# EasyEDA schematic 1-Schematic_Utilipi.json

## Sheets
1 Périphériques: TITLE: UtiliPi; REV: 3.0; Date: 2018-08-31; Sheet: 2/4; Drawn By: Nathan Bourgeois
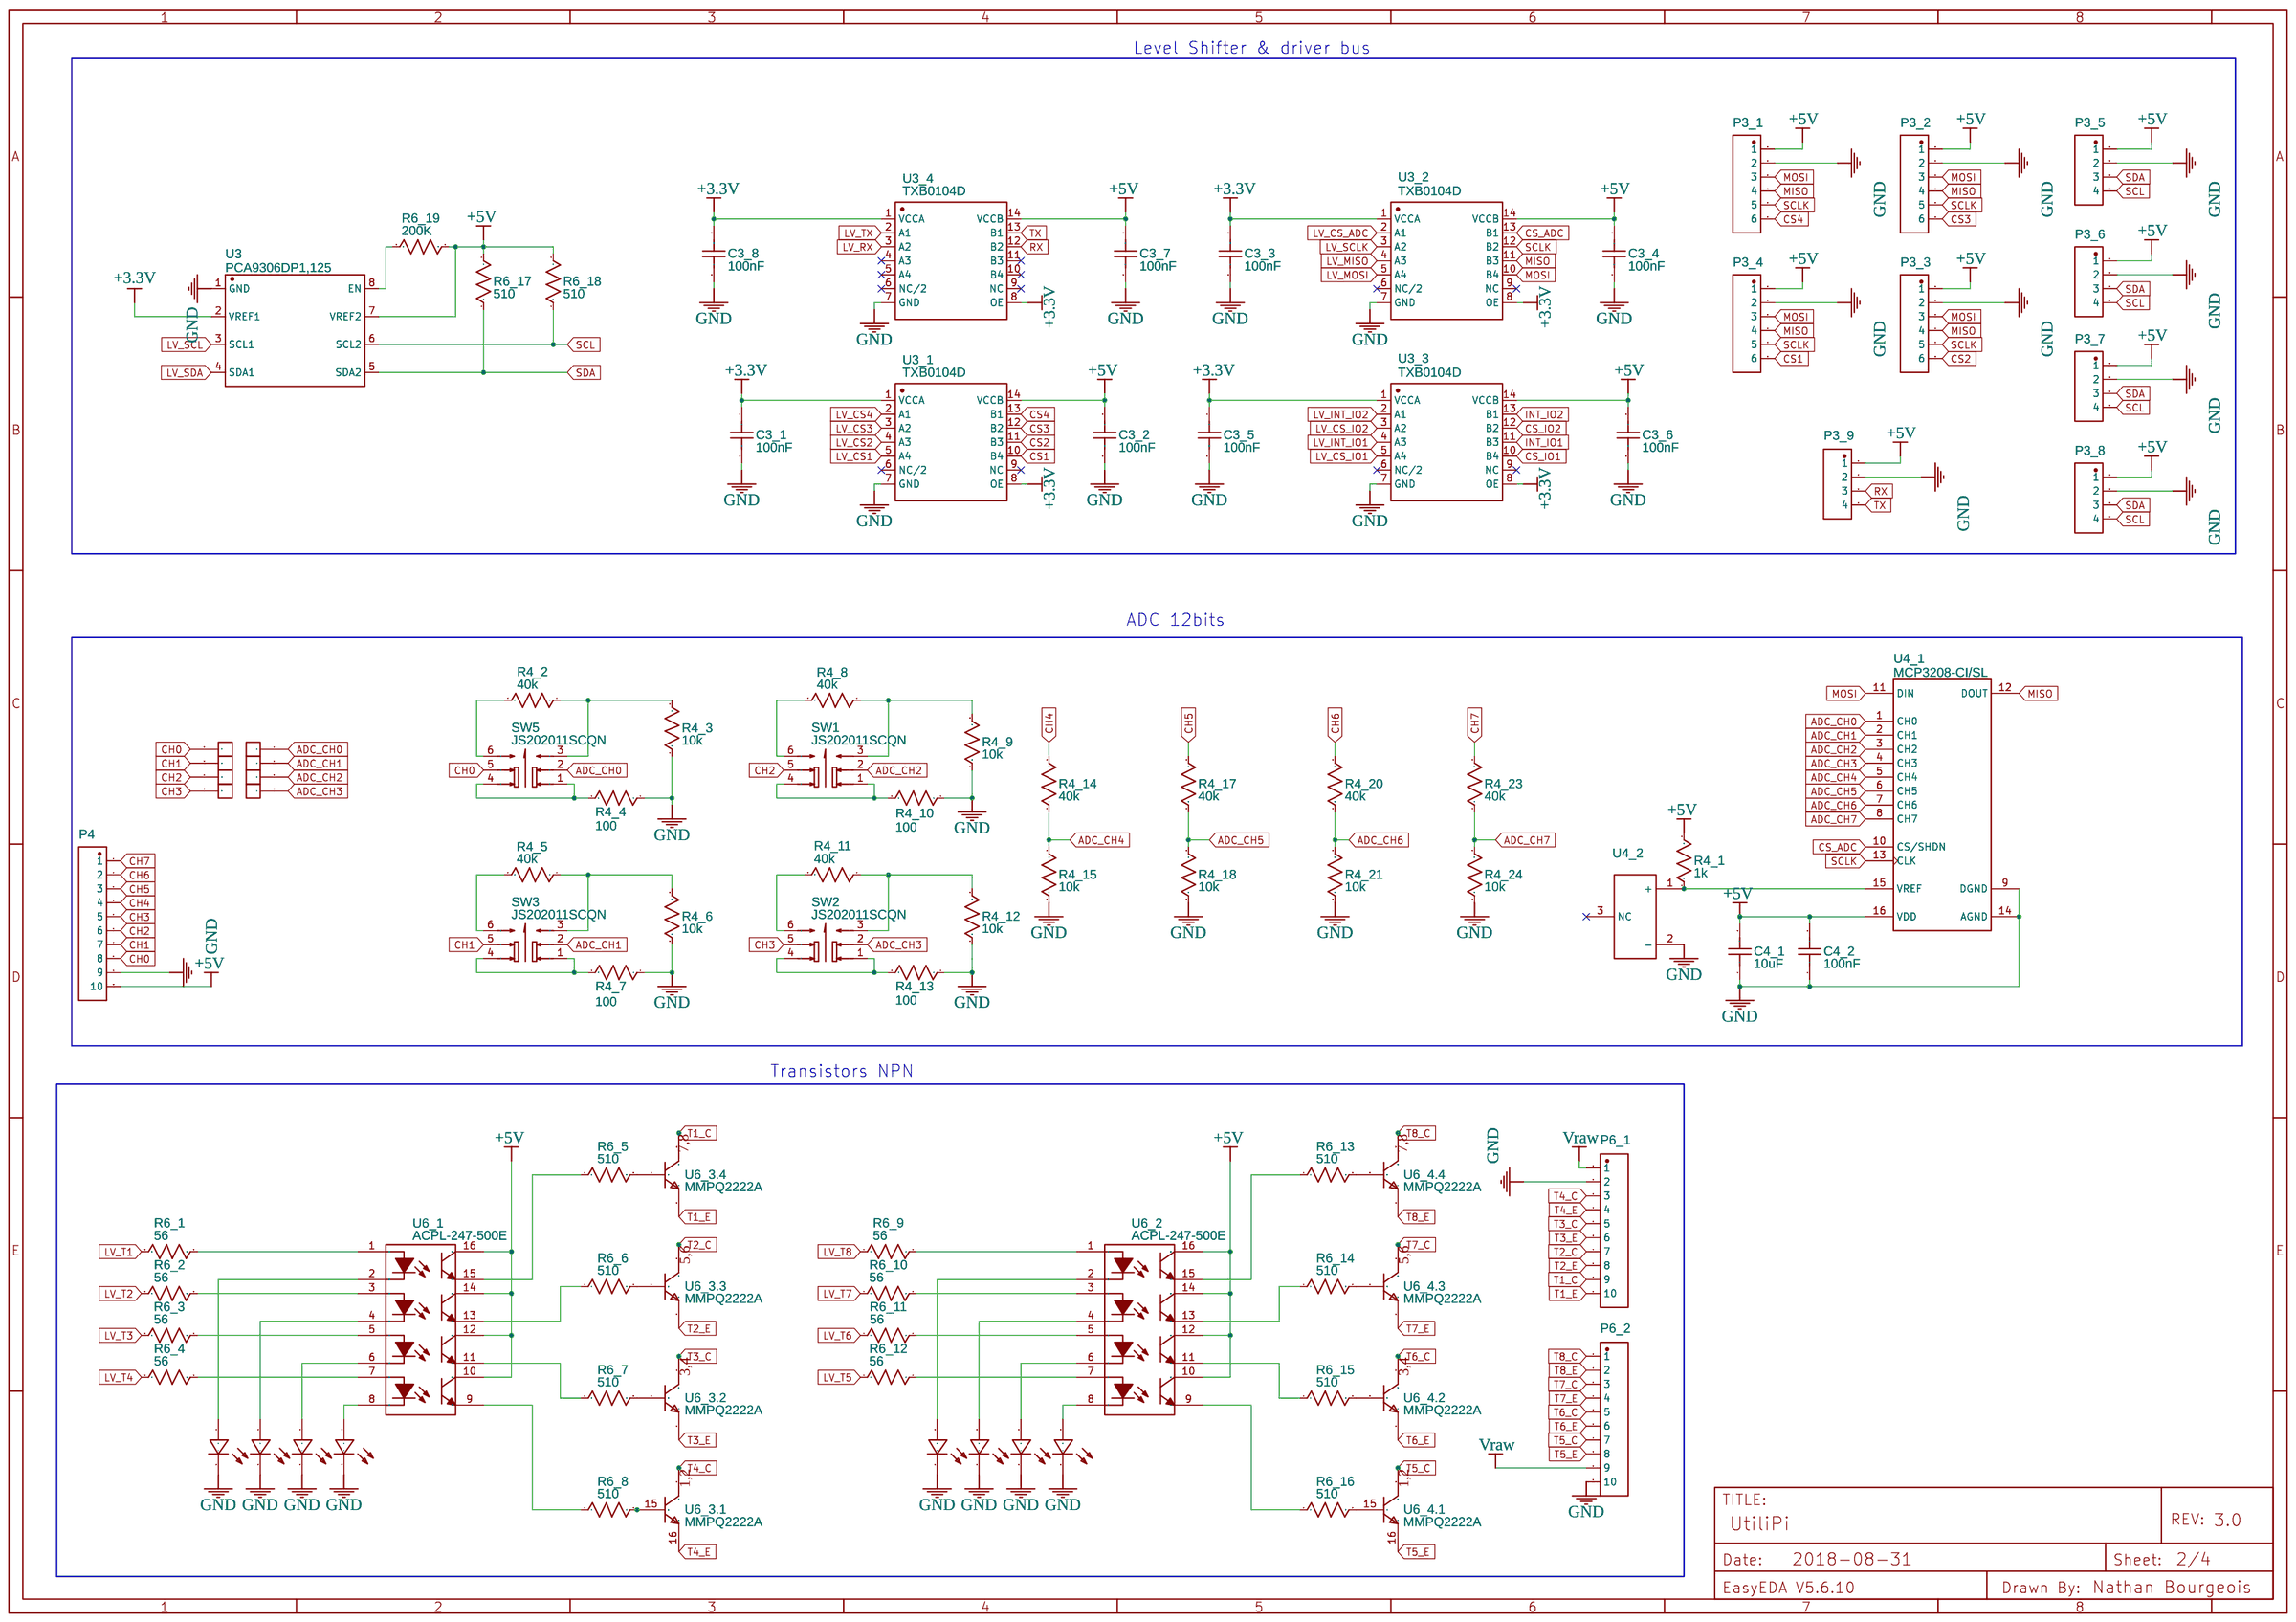
[diagram p0: Périphériques]
2 Micro controleur: TITLE: Utilipi; Date: 2019-04-05; Sheet: 1/4; Drawn By: Nathan49; Company: DIC
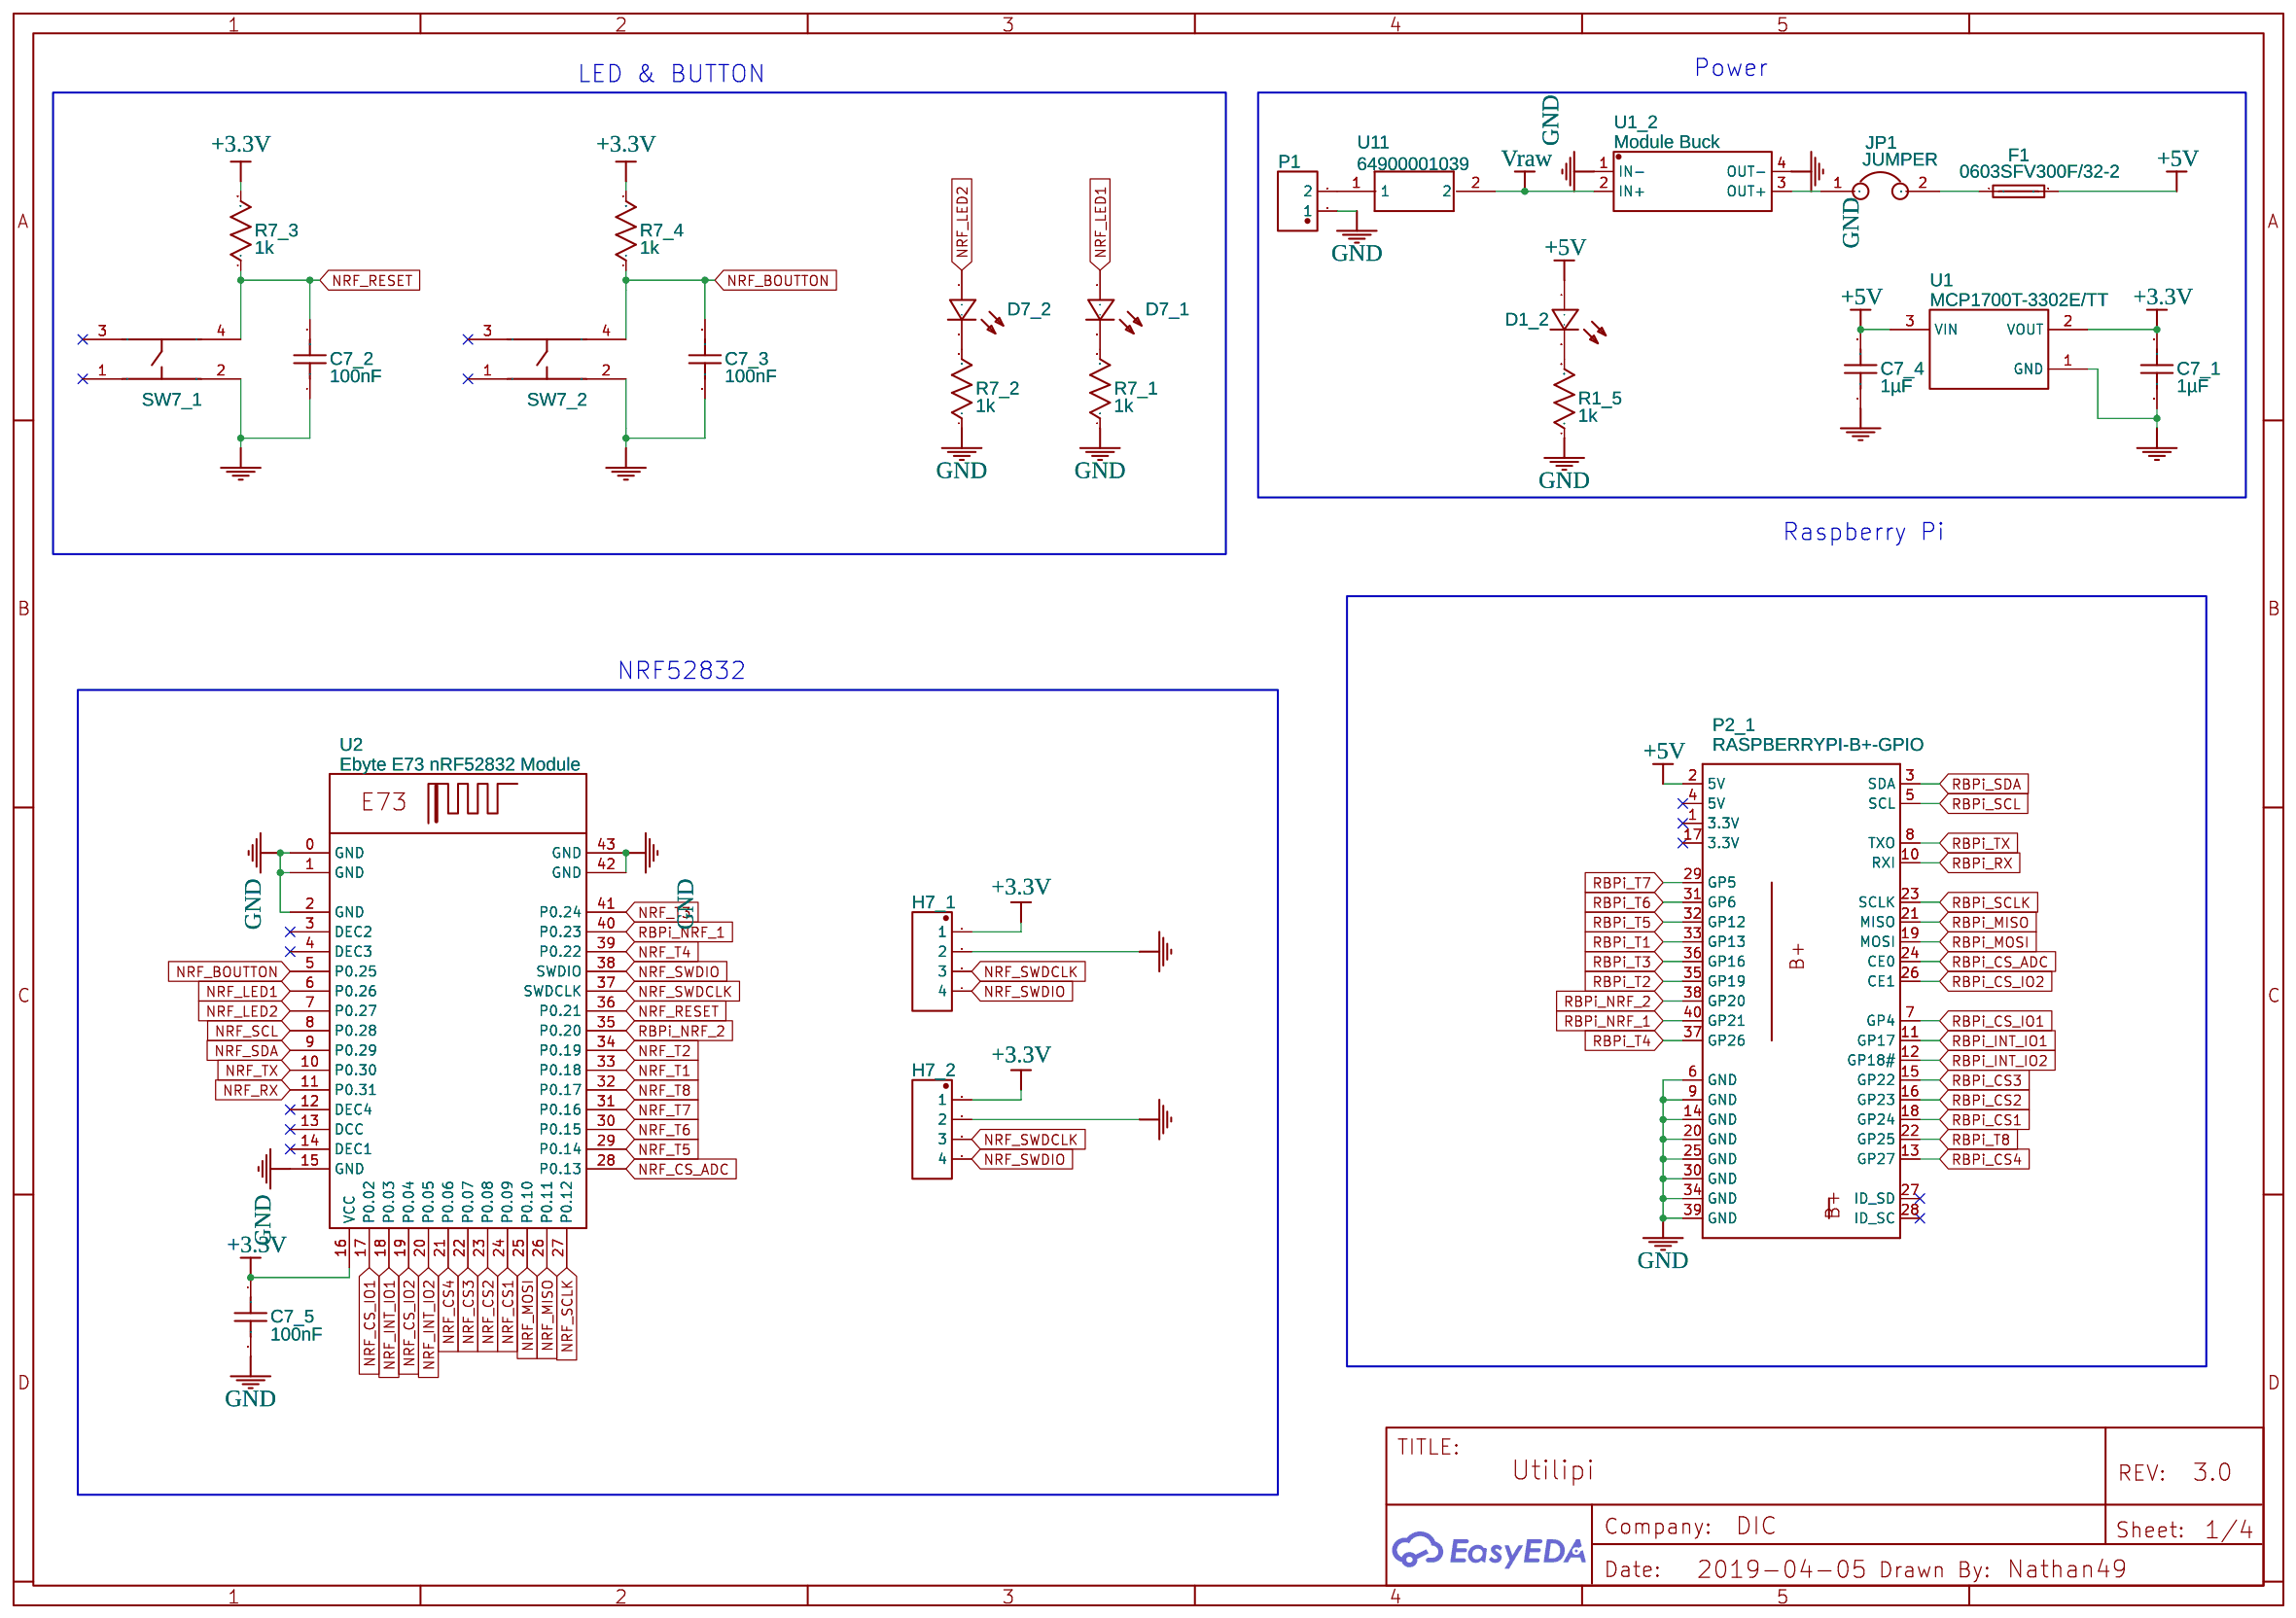
[diagram p1: Micro controleur]
3 IO_EXTENDER: TITLE: Utilipi; Date: 2019-07-12; Sheet: 3/4; Drawn By: Nathan49; Company: DIC
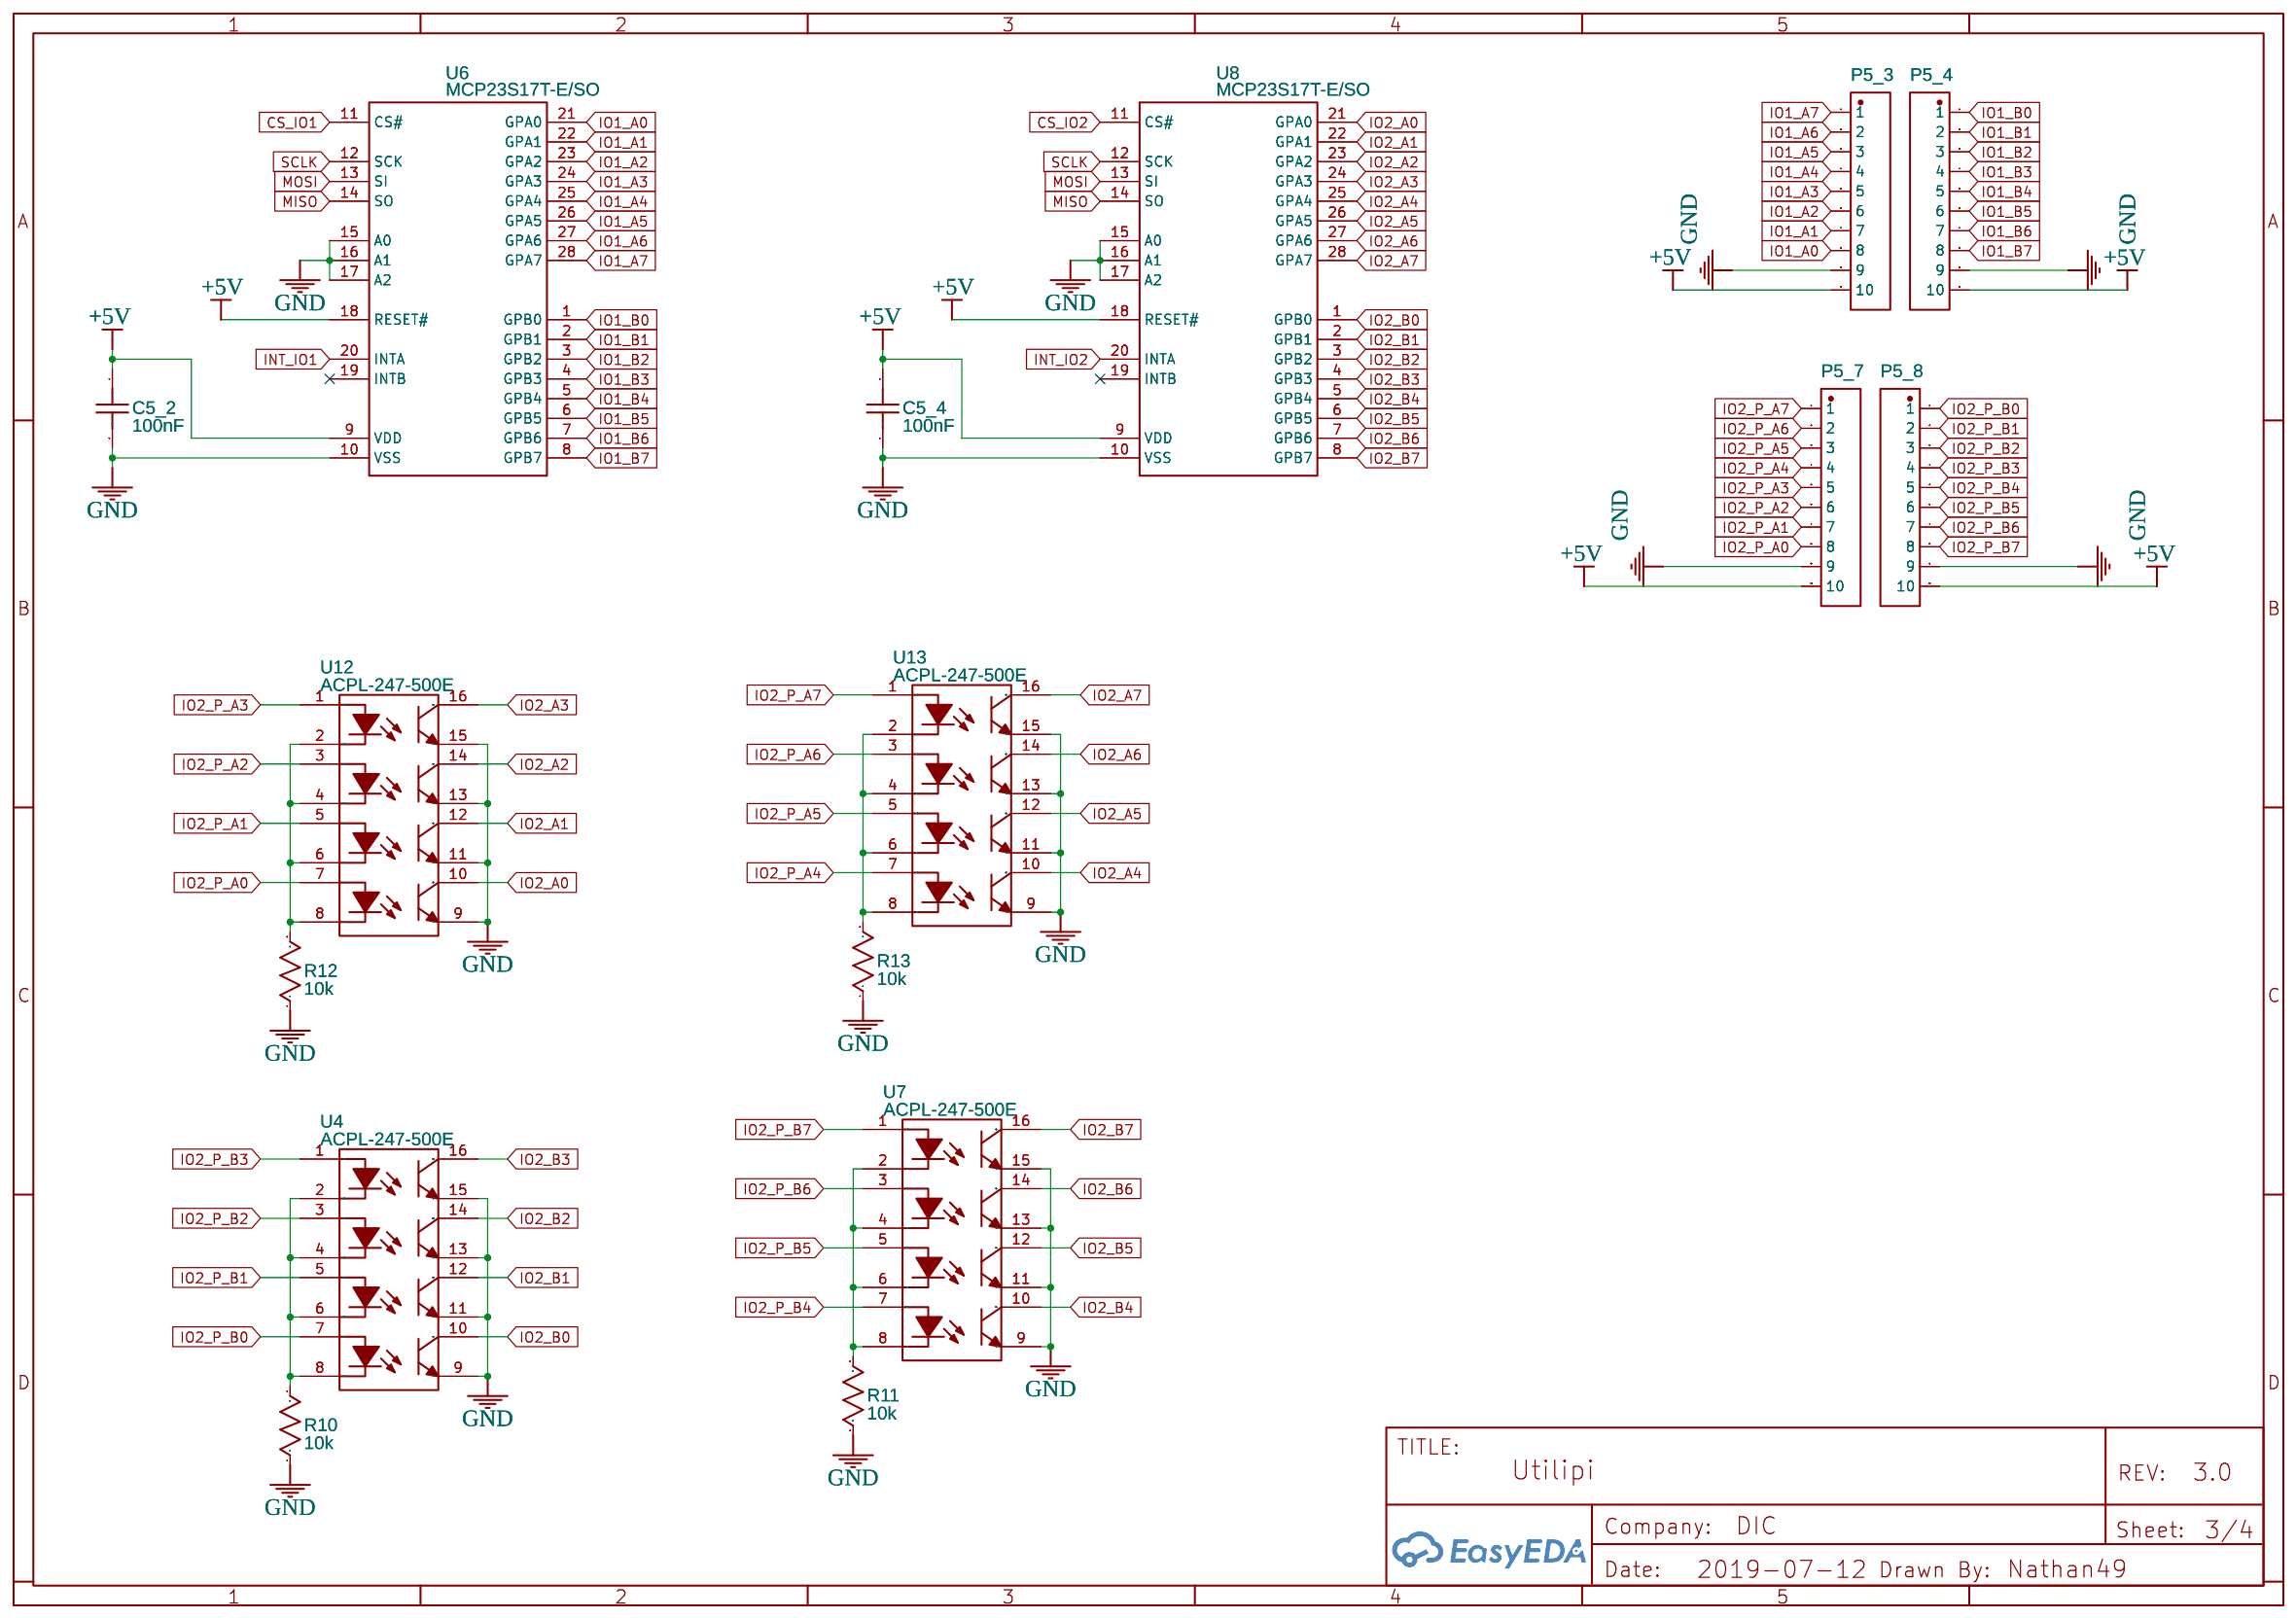
[diagram p2: IO_EXTENDER]
4 Solder Jumper: TITLE: Utilipi; Date: 2019-07-12; Sheet: 4/4; Drawn By: Nathan49; Company: DIC
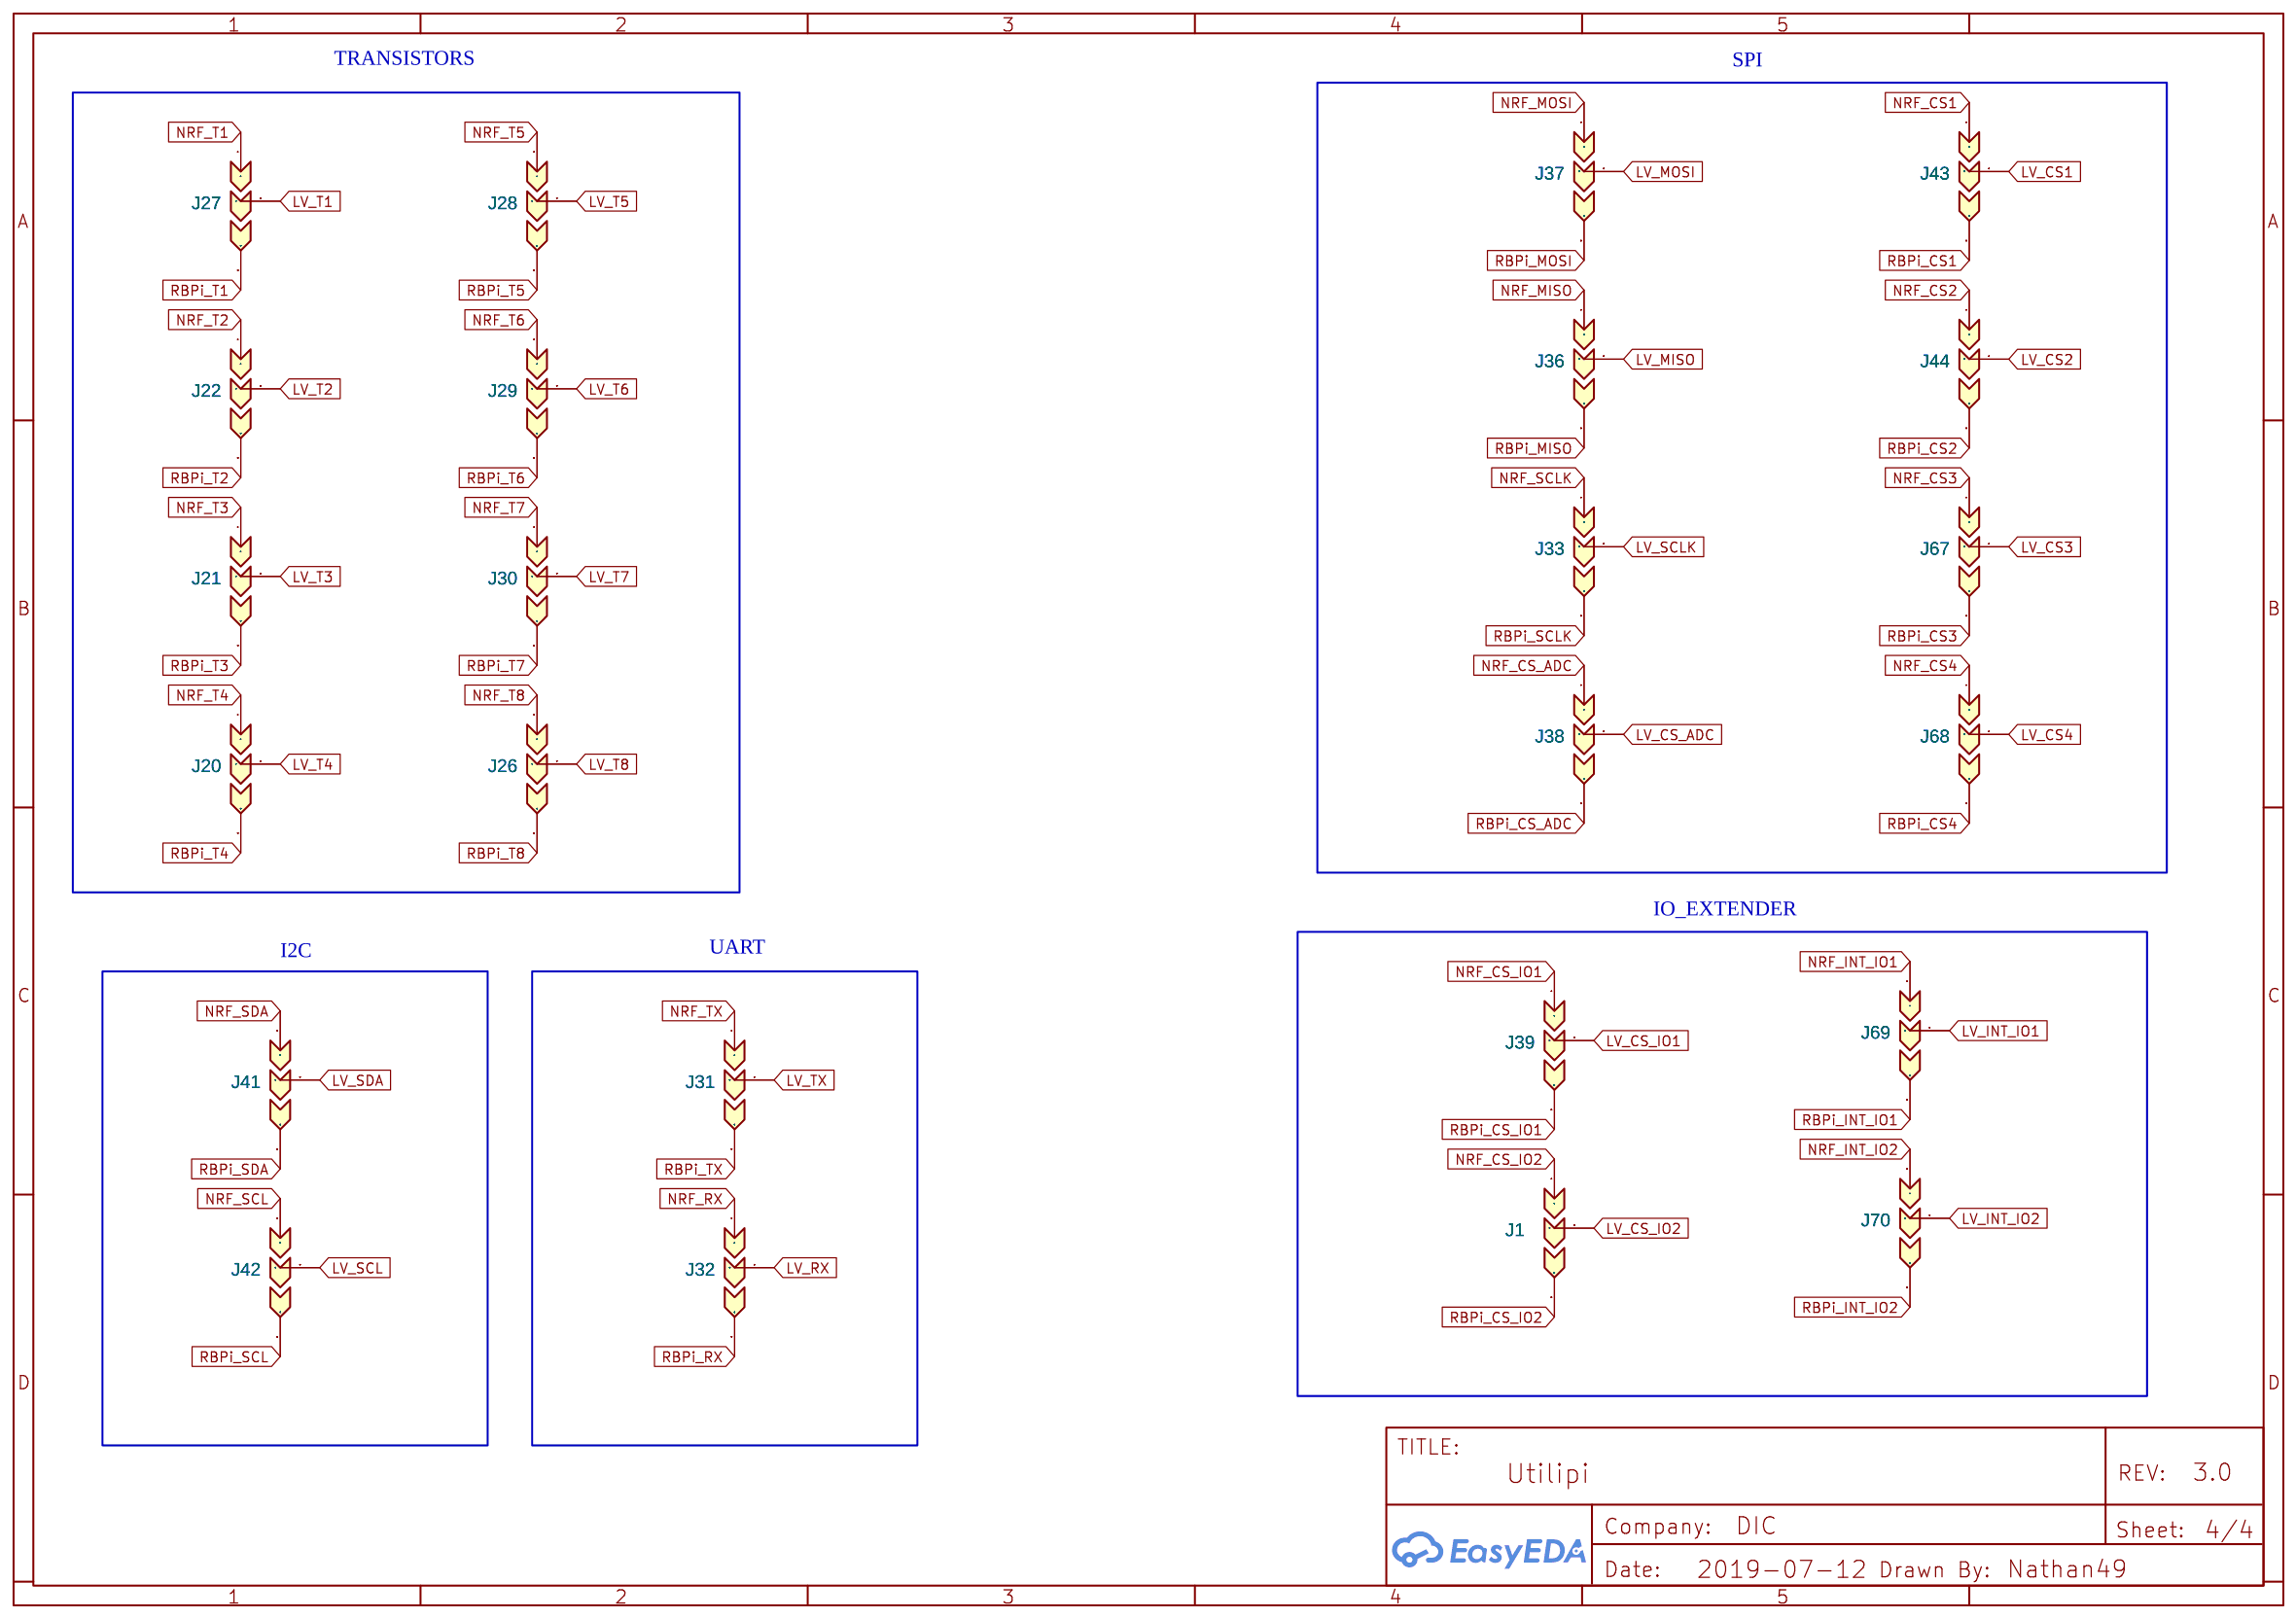
[diagram p3: Solder Jumper]

## Parts
sheet IO_EXTENDER
C5_2  100nF  [0805]
C5_4  100nF  [0805]
P5_3  RS PRO 10 Contacts  [RS PRO 10 CONTACTS]
P5_4  RS PRO 10 Contacts  [RS PRO 10 CONTACTS]
P5_7  RS PRO 10 Contacts  [RS PRO 10 CONTACTS]
P5_8  RS PRO 10 Contacts  [RS PRO 10 CONTACTS]
R10  10k  [0805]
R11  10k  [0805]
R12  10k  [0805]
R13  10k  [0805]
U4  ACPL-247-500E  [SOP-16]
U6  MCP23S17T-E/SO  [SOIC-28_300MIL]
U7  ACPL-247-500E  [SOP-16]
U8  MCP23S17T-E/SO  [SOIC-28_300MIL]
U12  ACPL-247-500E  [SOP-16]
U13  ACPL-247-500E  [SOP-16]
sheet Micro controleur
C7_1  1µF  [0805]
C7_2  100nF  [0805]
C7_3  100nF  [0805]
C7_4  1µF  [0805]
C7_5  100nF  [0805]
D1_2  LED-Blue(0805)  [LED-0805]
D7_1  LED-Blue(0805)  [LED-0805]
D7_2  LED-Blue(0805)  [LED-0805]
F1  0603SFV300F/32-2  [C0603]
H7_1  Header-Male-2.54_1x4  [DIP-1X4P-2.54MM-M]
H7_2  Header-Male-2.54_1x4  [POGO PAD]
JP1  JUMPER  [JUMPER2]
P1  RS PRO 2 Contacts  [RS PRO 2 CONTACTS]
P2_1  RASPBERRYPI-B+-GPIO  [2X20-SHROUDED]
R1_5  1k  [0805]
R7_1  1k  [0805]
R7_2  1k  [0805]
R7_3  1k  [0805]
R7_4  1k  [0805]
SW7_1  PTS810SJK250SMTRLFS  [PTS810SJK250SMTRLFS]
SW7_2  PTS810SJK250SMTRLFS  [PTS810SJK250SMTRLFS]
U1  MCP1700T-3302E/TT  [SOT-23(SOT-23-3)]
U1_2  Module Buck  [BUCK CMS]
U2  Ebyte E73 nRF52832 Module  [E73-2G4M04S1B]
U11  64900001039  [649-SERIES-HOLDER]
sheet Périphériques
C3_1  100nF  [0805]
C3_2  100nF  [0805]
C3_3  100nF  [0805]
C3_4  100nF  [0805]
C3_5  100nF  [0805]
C3_6  100nF  [0805]
C3_7  100nF  [0805]
C3_8  100nF  [0805]
C4_1  10uF  [0805]
C4_2  100nF  [0805]
D6_1  LED-Blue(0805)  [LED-0805]
D6_2  LED-Blue(0805)  [LED-0805]
D6_3  LED-Blue(0805)  [LED-0805]
D6_4  LED-Blue(0805)  [LED-0805]
D6_5  LED-Blue(0805)  [LED-0805]
D6_6  LED-Blue(0805)  [LED-0805]
D6_7  LED-Blue(0805)  [LED-0805]
D6_8  LED-Blue(0805)  [LED-0805]
P3_1  RS PRO 6 Contacts  [RS PRO 6 CONTACTS]
P3_2  RS PRO 6 Contacts  [RS PRO 6 CONTACTS]
P3_3  RS PRO 6 Contacts  [RS PRO 6 CONTACTS]
P3_4  RS PRO 6 Contacts  [RS PRO 6 CONTACTS]
P3_5  RS PRO 4 Contacts  [RS PRO 4 CONTACTS]
P3_6  RS PRO 4 Contacts  [RS PRO 4 CONTACTS]
P3_7  RS PRO 4 Contacts  [RS PRO 4 CONTACTS]
P3_8  RS PRO 4 Contacts  [RS PRO 4 CONTACTS]
P3_9  RS PRO 4 Contacts  [RS PRO 4 CONTACTS]
P4  RS PRO 10 Contacts  [RS PRO 10 CONTACTS]
P6_1  RS PRO 10 Contacts  [RS PRO 10 CONTACTS]
P6_2  RS PRO 10 Contacts  [RS PRO 10 CONTACTS]
R4_1  1k  [0805]
R4_2  40k  [0805]
R4_3  10k  [0805]
R4_4  100  [0805]
R4_5  40k  [0805]
R4_6  10k  [0805]
R4_7  100  [0805]
R4_8  40k  [0805]
R4_9  10k  [0805]
R4_10  100  [0805]
R4_11  40k  [0805]
R4_12  10k  [0805]
R4_13  100  [0805]
R4_14  40k  [0805]
R4_15  10k  [0805]
R4_17  40k  [0805]
R4_18  10k  [0805]
R4_20  40k  [0805]
R4_21  10k  [0805]
R4_23  40k  [0805]
R4_24  10k  [0805]
R6_1  56  [0805]
R6_2  56  [0805]
R6_3  56  [0805]
R6_4  56  [0805]
R6_5  510  [0805]
R6_6  510  [0805]
R6_7  510  [0805]
R6_8  510  [0805]
R6_9  56  [0805]
R6_10  56  [0805]
R6_11  56  [0805]
R6_12  56  [0805]
R6_13  510  [0805]
R6_14  510  [0805]
R6_15  510  [0805]
R6_16  510  [0805]
R6_17  510  [0805]
R6_18  510  [0805]
R6_19  200K  [0805]
SW1  JS202011SCQN  [JS202011SCQN_MODIFIED]
SW2  JS202011SCQN  [JS202011SCQN_MODIFIED]
SW3  JS202011SCQN  [JS202011SCQN_MODIFIED]
SW5  JS202011SCQN  [JS202011SCQN_MODIFIED]
U3  PCA9306DP1,125  [PCA9306DP1_TSSOP8]
U3_1  TXB0104D  [SOIC-14_150MIL]
U3_2  TXB0104D  [SOIC-14_150MIL]
U3_3  TXB0104D  [SOIC-14_150MIL]
U3_4  TXB0104D  [SOIC-14_150MIL]
U4_1  MCP3208-CI/SL  [SOIC-16_150MIL]
U4_2  LM4040AIM3-4.1/NOPB  [SOT-23(SOT-23-3)]
U5  solderpad x2  [SOLDERPAD X2]
U6_1  ACPL-247-500E  [SOP-16]
U6_2  ACPL-247-500E  [SOP-16]
U6_3  MMPQ2222A  [SOIC16N]  (sections 1,2,3,4)
U6_4  MMPQ2222A  [SOIC16N]  (sections 1,2,3,4)
U9  solderpad x2  [SOLDERPAD X2]
U10  solderpad x2  [SOLDERPAD X2]
U14  solderpad x2  [SOLDERPAD X2]
sheet Solder Jumper
J1  Solder Bridge 3-Way  [SOLDER BRIDGE 3-WAY]
J20  Solder Bridge 3-Way  [SOLDER BRIDGE 3-WAY]
J21  Solder Bridge 3-Way  [SOLDER BRIDGE 3-WAY]
J22  Solder Bridge 3-Way  [SOLDER BRIDGE 3-WAY]
J26  Solder Bridge 3-Way  [SOLDER BRIDGE 3-WAY]
J27  Solder Bridge 3-Way  [SOLDER BRIDGE 3-WAY]
J28  Solder Bridge 3-Way  [SOLDER BRIDGE 3-WAY]
J29  Solder Bridge 3-Way  [SOLDER BRIDGE 3-WAY]
J30  Solder Bridge 3-Way  [SOLDER BRIDGE 3-WAY]
J31  Solder Bridge 3-Way  [SOLDER BRIDGE 3-WAY]
J32  Solder Bridge 3-Way  [SOLDER BRIDGE 3-WAY]
J33  Solder Bridge 3-Way  [SOLDER BRIDGE 3-WAY]
J36  Solder Bridge 3-Way  [SOLDER BRIDGE 3-WAY]
J37  Solder Bridge 3-Way  [SOLDER BRIDGE 3-WAY]
J38  Solder Bridge 3-Way  [SOLDER BRIDGE 3-WAY]
J39  Solder Bridge 3-Way  [SOLDER BRIDGE 3-WAY]
J41  Solder Bridge 3-Way  [SOLDER BRIDGE 3-WAY]
J42  Solder Bridge 3-Way  [SOLDER BRIDGE 3-WAY]
J43  Solder Bridge 3-Way  [SOLDER BRIDGE 3-WAY]
J44  Solder Bridge 3-Way  [SOLDER BRIDGE 3-WAY]
J67  Solder Bridge 3-Way  [SOLDER BRIDGE 3-WAY]
J68  Solder Bridge 3-Way  [SOLDER BRIDGE 3-WAY]
J69  Solder Bridge 3-Way  [SOLDER BRIDGE 3-WAY]
J70  Solder Bridge 3-Way  [SOLDER BRIDGE 3-WAY]

## Library data of the parts
C3_1-C3_8 C4_1 C4_2 C5_2 C5_4 C7_1-C7_5 = Cap_0805_US: Manufacturer Part: ?
P4 P5_3 P5_4 P5_7 P5_8 P6_1 P6_2 = -: Manufacturer Part: ?; Contributor: Nathan49; Supplier Part: https://fr.aliexpress.com/store/product/10P-Plug-component-Pitch-3-50mm-10Pins-right-angle-pin-instead-of-PHOENIX-CONTACT-MC-1/938180_32591204066.html?spm=a2g0w.12010612.8148356.17.564666b9JPgQYm
R6_1-R6_19 R7_1-R7_4 R10-R13 = Res_1206(1/4W)_US: Manufacturer Part: ?
U4 U6_1 U6_2 U7 U12 U13 = -: Supplier: RS-Online; Manufacturer: ISOCOM; LCSC: C83832; Contributor: LCSC; Supplier Part: 693-6807
U6 U8 = -: Supplier: LCSC; Manufacturer: MICROCHIP; Contributor: LCSC; Supplier Part: C144293; LCSC Assembly: Yes; SMT Type: Extend
D1_2 D6_1-D6_8 D7_1 D7_2 = -: Supplier: LCSC; Manufacturer: Everlight Elec; Manufacturer Part: 17-21/BHC-XL2M2TY/3T; Supplier Part: C72035
F1 = -: Supplier: LCSC; Manufacturer Part: Glass tube fuse2A 3F 250VAC; Manufacturer: XCFuse; image: //image.lceda.cn/szlcsc/C71017.jpg; Supplier Part: C71017
H7_1 H7_2 = -: Supplier: LCSC; Manufacturer: Ckmtw; Manufacturer Part: 210S-1*4P L=11.6MMGold-plated black; Contributor: LCSC; Supplier Part: C124378
JP1 = -: Contributor: KiCad; Manufacturer Part: ?
P1 = -: Contributor: Nathan49; Supplier Part: 897-1026; Supplier: RS-Online; Manufacturer: 897-0998
P2_1 = -: Raspberry Pi B+ GPIO Header; Contributor: SparkFun; Manufacturer Part: ?
R1_5 R4_1 R4_3-R4_15 R4_17 R4_18 R4_20 R4_21 R4_23 R4_24 = Res_0805(1/8W)_US: Manufacturer Part: ?
SW7_1 SW7_2 = -: Supplier: LCSC; Supplier Part: C221896; Manufacturer: C&K; Contributor: LCSC
U1 = -: Supplier: LCSC; Manufacturer: MICROCHIP; image: //image.lceda.cn/szlcsc/C39051.jpg; Supplier Part: C39051; LCSC Assembly: Yes; SMT Type: Extend
U1_2 = -: Manufacturer Part: ?; Supplier: Ali express; Supplier Part: https://fr.aliexpress.com/item/mini-DC-DC-Converter-Step-Down-buck-Power-Supply-Module-for-Flight-Control-Car/2038556858.html?spm=a2g0s.9042311.0.0.5bf36c37EOK96X
U2 = -: Manufacturer: EBYTE; Supplier Part: undefined; Supplier: Aliexpress; Contributor: fbeer57; Link: https://www.aliexpress.com/item/CDEBYTE-E73-2G4M04S-BLE-4-2-5-0-long-distance-100m-2-4GHz-SMD-ARM-Core/32820692238.html
U11 = -: Contributor: Ferenc Wurm; Manufacturer Part: ?
P3_1-P3_4 = -: Manufacturer Part: ?; Contributor: Nathan49; Supplier Part: 874-5170; Supplier: RS-Online; Manufacturer: 897-1017
P3_5-P3_9 = -: Manufacturer Part: ?; Contributor: Nathan49; Supplier Part: 897-1039; Supplier: RS-Online; Manufacturer: 897-1004
R4_2 = Res_0805(1/8W)_US: Manufacturer Part: ?; Supplier: RS-Online; Supplier Part: undefined
SW1-SW3 SW5 = -: Supplier: LCSC; Supplier Part: C221666; Manufacturer: C&K; Contributor: LCSC
U3 = -: Supplier: LCSC; Manufacturer: NXP; Contributor: fan4dry4; Supplier Part: C128835
U3_1-U3_4 = -: Manufacturer Part: ?; Supplier: RS-Online; Supplier Part: 709-2778
U4_1 = -: Supplier: RS-Online; Manufacturer: MICROCHIP; Manufacturer Part: MCP3208-BI/SL; LCSC: C16939; image: //image.lceda.cn/szlcsc/C16939.jpg; Contributor: LCSC; Supplier Part: 770-9757
U4_2 = -: Supplier: RS-Online; Manufacturer: TI; LCSC: C126807; Contributor: LCSC; Supplier Part: 533-8467
U5 U9 U10 U14 = -: Contributor: Nathan49
U6_3 U6_4 = -: Quad General Purpose Transistor NPN Silicon; Manufacturer Part: ?; Supplier: RS-Online; Supplier Part: 807-4850
J1 J20-J22 J26-J33 J36-J39 J41-J44 J67-J70 = -: Manufacturer Part: ?; Contributor: gerdmuller.de

## Nets
+3.3V: C3_1.1 C3_3.1 C3_5.1 C3_8.1 C7_1.2 C7_5.1 H7_1.1 H7_2.1 R7_3.2 R7_4.2 U1.2(VOUT) U2.16(VCC) U3.2(VREF1) U3_1.1(VCCA) U3_1.8(OE) U3_2.1(VCCA) U3_2.8(OE) U3_3.1(VCCA) U3_3.8(OE) U3_4.1(VCCA) U3_4.8(OE)
+5V: C3_2.1 C3_4.1 C3_6.1 C3_7.1 C4_1.2 C4_2.2 C5_2.1 C5_4.1 C7_4.2 D1_2.1(+) F1.2 P2_1.2(5V) P3_1.1 P3_2.1 P3_3.1 P3_4.1 P3_5.1 P3_6.1 P3_7.1 P3_8.1 P3_9.1 P4.10 P5_3.10 P5_4.10 P5_7.10 P5_8.10 R4_1.2 R6_17.2 R6_18.2 R6_19.1 U1.3(VIN) U3.7(VREF2) U3_1.14(VCCB) U3_2.14(VCCB) U3_3.14(VCCB) U3_4.14(VCCB) U4_1.16(VDD) U6.9(VDD) U6.18(RESET#) U6_1.10(COL) U6_1.12(COL) U6_1.14(COL) U6_1.16(COL) U6_2.10(COL) U6_2.12(COL) U6_2.14(COL) U6_2.16(COL) U8.9(VDD) U8.18(RESET#)
GND: C3_1.2 C3_2.2 C3_3.2 C3_4.2 C3_5.2 C3_6.2 C3_7.2 C3_8.2 C4_1.1 C4_2.1 C5_2.2 C5_4.2 C7_1.1 C7_2.1 C7_3.1 C7_4.1 C7_5.2 D6_1.2(-) D6_2.2(-) D6_3.2(-) D6_4.2(-) D6_5.2(-) D6_6.2(-) D6_7.2(-) D6_8.2(-) H7_1.2 H7_2.2 P1.1 P2_1.6(GND) P2_1.9(GND) P2_1.14(GND) P2_1.20(GND) P2_1.25(GND) P2_1.30(GND) P2_1.34(GND) P2_1.39(GND) P3_1.2 P3_2.2 P3_3.2 P3_4.2 P3_5.2 P3_6.2 P3_7.2 P3_8.2 P3_9.2 P4.9 P5_3.9 P5_4.9 P5_7.9 P5_8.9 P6_1.2 P6_2.10 R1_5.1 R4_3.1 R4_4.1 R4_6.1 R4_7.1 R4_9.1 R4_10.1 R4_12.1 R4_13.1 R4_15.1 R4_18.1 R4_21.1 R4_24.1 R7_1.1 R7_2.1 R10.1 R11.1 R12.1 R13.1 SW7_1.2 SW7_2.2 U1.1(GND) U1_2.1(IN-) U1_2.4(OUT-) U2.0(GND) U2.1(GND) U2.2(GND) U2.15(GND) U2.42(GND) U2.43(GND) U3.1(GND) U3_1.7(GND) U3_2.7(GND) U3_3.7(GND) U3_4.7(GND) U4.9(EM) U4.11(EM) U4.13(EM) U4.15(EM) U4_1.9(DGND) U4_1.14(AGND) U4_2.2(-) U6.10(VSS) U6.15(A0) U6.16(A1) U6.17(A2) U7.9(EM) U7.11(EM) U7.13(EM) U7.15(EM) U8.10(VSS) U8.15(A0) U8.16(A1) U8.17(A2) U12.9(EM) U12.11(EM) U12.13(EM) U12.15(EM) U13.9(EM) U13.11(EM) U13.13(EM) U13.15(EM)
ADC_CH0: SW5.2 U4_1.1(CH0) U5.1
ADC_CH1: SW3.2 U4_1.2(CH1) U9.1
ADC_CH2: SW1.2 U4_1.3(CH2) U10.1
ADC_CH3: SW2.2 U4_1.4(CH3) U14.1
ADC_CH4: R4_14.1 R4_15.2 U4_1.5(CH4)
ADC_CH5: R4_17.1 R4_18.2 U4_1.6(CH5)
ADC_CH6: R4_20.1 R4_21.2 U4_1.7(CH6)
ADC_CH7: R4_23.1 R4_24.2 U4_1.8(CH7)
CH0: P4.8 SW5.5 U5.2
CH1: P4.7 SW3.5 U9.2
CH2: P4.6 SW1.5 U10.2
CH3: P4.5 SW2.5 U14.2
CH4: P4.4 R4_14.2
CH5: P4.3 R4_17.2
CH6: P4.2 R4_20.2
CH7: P4.1 R4_23.2
CS1: P3_4.6 U3_1.10(B4)
CS2: P3_3.6 U3_1.11(B3)
CS3: P3_2.6 U3_1.12(B2)
CS4: P3_1.6 U3_1.13(B1)
CS_ADC: U3_2.13(B1) U4_1.10(CS/SHDN)
CS_IO1: U3_3.10(B4) U6.11(CS#)
CS_IO2: U3_3.12(B2) U8.11(CS#)
INT_IO1: U3_3.11(B3) U6.20(INTA)
INT_IO2: U3_3.13(B1) U8.20(INTA)
IO1_A0: P5_3.8 U6.21(GPA0)
IO1_A1: P5_3.7 U6.22(GPA1)
IO1_A2: P5_3.6 U6.23(GPA2)
IO1_A3: P5_3.5 U6.24(GPA3)
IO1_A4: P5_3.4 U6.25(GPA4)
IO1_A5: P5_3.3 U6.26(GPA5)
IO1_A6: P5_3.2 U6.27(GPA6)
IO1_A7: P5_3.1 U6.28(GPA7)
IO1_B0: P5_4.1 U6.1(GPB0)
IO1_B1: P5_4.2 U6.2(GPB1)
IO1_B2: P5_4.3 U6.3(GPB2)
IO1_B3: P5_4.4 U6.4(GPB3)
IO1_B4: P5_4.5 U6.5(GPB4)
IO1_B5: P5_4.6 U6.6(GPB5)
IO1_B6: P5_4.7 U6.7(GPB6)
IO1_B7: P5_4.8 U6.8(GPB7)
IO2_A0: U8.21(GPA0) U12.10(COL)
IO2_A1: U8.22(GPA1) U12.12(COL)
IO2_A2: U8.23(GPA2) U12.14(COL)
IO2_A3: U8.24(GPA3) U12.16(COL)
IO2_A4: U8.25(GPA4) U13.10(COL)
IO2_A5: U8.26(GPA5) U13.12(COL)
IO2_A6: U8.27(GPA6) U13.14(COL)
IO2_A7: U8.28(GPA7) U13.16(COL)
IO2_B0: U4.10(COL) U8.1(GPB0)
IO2_B1: U4.12(COL) U8.2(GPB1)
IO2_B2: U4.14(COL) U8.3(GPB2)
IO2_B3: U4.16(COL) U8.4(GPB3)
IO2_B4: U7.10(COL) U8.5(GPB4)
IO2_B5: U7.12(COL) U8.6(GPB5)
IO2_B6: U7.14(COL) U8.7(GPB6)
IO2_B7: U7.16(COL) U8.8(GPB7)
IO2_P_A0: P5_7.8 U12.7(AN)
IO2_P_A1: P5_7.7 U12.5(AN)
IO2_P_A2: P5_7.6 U12.3(AN)
IO2_P_A3: P5_7.5 U12.1(AN)
IO2_P_A4: P5_7.4 U13.7(AN)
IO2_P_A5: P5_7.3 U13.5(AN)
IO2_P_A6: P5_7.2 U13.3(AN)
IO2_P_A7: P5_7.1 U13.1(AN)
IO2_P_B0: P5_8.1 U4.7(AN)
IO2_P_B1: P5_8.2 U4.5(AN)
IO2_P_B2: P5_8.3 U4.3(AN)
IO2_P_B3: P5_8.4 U4.1(AN)
IO2_P_B4: P5_8.5 U7.7(AN)
IO2_P_B5: P5_8.6 U7.5(AN)
IO2_P_B6: P5_8.7 U7.3(AN)
IO2_P_B7: P5_8.8 U7.1(AN)
LV_CS1: J43.2 U3_1.5(A4)
LV_CS2: J44.2 U3_1.4(A3)
LV_CS3: J67.2 U3_1.3(A2)
LV_CS4: J68.2 U3_1.2(A1)
LV_CS_ADC: J38.2 U3_2.2(A1)
LV_CS_IO1: J39.2 U3_3.5(A4)
LV_CS_IO2: J1.2 U3_3.3(A2)
LV_INT_IO1: J69.2 U3_3.4(A3)
LV_INT_IO2: J70.2 U3_3.2(A1)
LV_MISO: J36.2 U3_2.4(A3)
LV_MOSI: J37.2 U3_2.5(A4)
LV_RX: J32.2 U3_4.3(A2)
LV_SCL: J42.2 U3.3(SCL1)
LV_SCLK: J33.2 U3_2.3(A2)
LV_SDA: J41.2 U3.4(SDA1)
LV_T1: J27.2 R6_1.1
LV_T2: J22.2 R6_2.1
LV_T3: J21.2 R6_3.1
LV_T4: J20.2 R6_4.1
LV_T5: J28.2 R6_12.1
LV_T6: J29.2 R6_11.1
LV_T7: J30.2 R6_10.1
LV_T8: J26.2 R6_9.1
LV_TX: J31.2 U3_4.2(A1)
MISO: P3_1.4 P3_2.4 P3_3.4 P3_4.4 U3_2.11(B3) U4_1.12(DOUT) U6.14(SO) U8.14(SO)
MOSI: P3_1.3 P3_2.3 P3_3.3 P3_4.3 U3_2.10(B4) U4_1.11(DIN) U6.13(SI) U8.13(SI)
NRF_BOUTTON: C7_3.2 R7_4.1 SW7_2.4 U2.5(P0.25)
NRF_CS1: J43.1 U2.24(P0.09)
NRF_CS2: J44.1 U2.23(P0.08)
NRF_CS3: J67.1 U2.22(P0.07)
NRF_CS4: J68.1 U2.21(P0.06)
NRF_CS_ADC: J38.1 U2.28(P0.13)
NRF_CS_IO1: J39.1 U2.17(P0.02)
NRF_CS_IO2: J1.1 U2.19(P0.04)
NRF_INT_IO1: J69.1 U2.18(P0.03)
NRF_INT_IO2: J70.1 U2.20(P0.05)
NRF_LED1: D7_1.1(+) U2.6(P0.26)
NRF_LED2: D7_2.1(+) U2.7(P0.27)
NRF_MISO: J36.1 U2.26(P0.11)
NRF_MOSI: J37.1 U2.25(P0.10)
NRF_RESET: C7_2.2 R7_3.1 SW7_1.4 U2.36(P0.21)
NRF_RX: J32.1 U2.11(P0.31)
NRF_SCL: J42.1 U2.8(P0.28)
NRF_SCLK: J33.1 U2.27(P0.12)
NRF_SDA: J41.1 U2.9(P0.29)
NRF_SWDCLK: H7_1.3 H7_2.3 U2.37(SWDCLK)
NRF_SWDIO: H7_1.4 H7_2.4 U2.38(SWDIO)
NRF_T1: J27.1 U2.33(P0.18)
NRF_T2: J22.1 U2.34(P0.19)
NRF_T3: J21.1 U2.41(P0.24)
NRF_T4: J20.1 U2.39(P0.22)
NRF_T5: J28.1 U2.29(P0.14)
NRF_T6: J29.1 U2.30(P0.15)
NRF_T7: J30.1 U2.31(P0.16)
NRF_T8: J26.1 U2.32(P0.17)
NRF_TX: J31.1 U2.10(P0.30)
RBPi_CS1: J43.3 P2_1.18(GP24)
RBPi_CS2: J44.3 P2_1.16(GP23)
RBPi_CS3: J67.3 P2_1.15(GP22)
RBPi_CS4: J68.3 P2_1.13(GP27)
RBPi_CS_ADC: J38.3 P2_1.24(CE0)
RBPi_CS_IO1: J39.3 P2_1.7(GP4)
RBPi_CS_IO2: J1.3 P2_1.26(CE1)
RBPi_INT_IO1: J69.3 P2_1.11(GP17)
RBPi_INT_IO2: J70.3 P2_1.12(GP18#)
RBPi_MISO: J36.3 P2_1.21(MISO)
RBPi_MOSI: J37.3 P2_1.19(MOSI)
RBPi_NRF_1: P2_1.40(GP21) U2.40(P0.23)
RBPi_NRF_2: P2_1.38(GP20) U2.35(P0.20)
RBPi_RX: J32.3 P2_1.10(RXI)
RBPi_SCL: J42.3 P2_1.5(SCL)
RBPi_SCLK: J33.3 P2_1.23(SCLK)
RBPi_SDA: J41.3 P2_1.3(SDA)
RBPi_T1: J27.3 P2_1.33(GP13)
RBPi_T2: J22.3 P2_1.35(GP19)
RBPi_T3: J21.3 P2_1.36(GP16)
RBPi_T4: J20.3 P2_1.37(GP26)
RBPi_T5: J28.3 P2_1.32(GP12)
RBPi_T6: J29.3 P2_1.31(GP6)
RBPi_T7: J30.3 P2_1.29(GP5)
RBPi_T8: J26.3 P2_1.22(GP25)
RBPi_TX: J31.3 P2_1.8(TXO)
RX: P3_9.3 U3_4.12(B2)
SCL: P3_5.4 P3_6.4 P3_7.4 P3_8.4 R6_18.1 U3.6(SCL2)
SCLK: P3_1.5 P3_2.5 P3_3.5 P3_4.5 U3_2.12(B2) U4_1.13(CLK) U6.12(SCK) U8.12(SCK)
SDA: P3_5.3 P3_6.3 P3_7.3 P3_8.3 R6_17.1 U3.5(SDA2)
T1_C: P6_1.9 U6_3.7(C) U6_3.8(C)
T1_E: P6_1.10 U6_3.10(E)
T2_C: P6_1.7 U6_3.5(C) U6_3.6(C)
T2_E: P6_1.8 U6_3.12(E)
T3_C: P6_1.5 U6_3.3(C) U6_3.4(C)
T3_E: P6_1.6 U6_3.14(E)
T4_C: P6_1.3 U6_3.1(C) U6_3.2(C)
T4_E: P6_1.4 U6_3.16(E)
T5_C: P6_2.7 U6_4.1(C) U6_4.2(C)
T5_E: P6_2.8 U6_4.16(E)
T6_C: P6_2.5 U6_4.3(C) U6_4.4(C)
T6_E: P6_2.6 U6_4.14(E)
T7_C: P6_2.3 U6_4.5(C) U6_4.6(C)
T7_E: P6_2.4 U6_4.12(E)
T8_C: P6_2.1 U6_4.7(C) U6_4.8(C)
T8_E: P6_2.2 U6_4.10(E)
TX: P3_9.4 U3_4.13(B1)
Vraw: P6_1.1 P6_2.9 U1_2.2(IN+) U11.2
D1_2_2: D1_2.2(-) R1_5.2
D7_1_2: D7_1.2(-) R7_1.2
D7_2_2: D7_2.2(-) R7_2.2
JP1_2: F1.1 JP1.2
P1_2: P1.2 U11.1
R4_2_1: R4_2.1 R4_3.2 SW5.3
R4_2_2: R4_2.2 SW5.6
R4_4_2: R4_4.2 SW5.1 SW5.4
R4_5_1: R4_5.1 R4_6.2 SW3.3
R4_5_2: R4_5.2 SW3.6
R4_7_2: R4_7.2 SW3.1 SW3.4
R4_8_1: R4_8.1 R4_9.2 SW1.3
R4_8_2: R4_8.2 SW1.6
R4_10_2: R4_10.2 SW1.1 SW1.4
R4_11_1: R4_11.1 R4_12.2 SW2.3
R4_11_2: R4_11.2 SW2.6
R4_13_2: R4_13.2 SW2.1 SW2.4
R6_4_2: R6_4.2 U6_1.7(AN)
R6_5_1: R6_5.1 U6_1.15(EM)
R6_5_2: R6_5.2 U6_3.9(B)
R6_6_2: R6_6.2 U6_3.11(B)
R6_7_2: R6_7.2 U6_3.13(B)
R6_8_2: R6_8.2 U6_3.15(B)
R6_12_2: R6_12.2 U6_2.7(AN)
R6_13_1: R6_13.1 U6_2.15(EM)
R6_13_2: R6_13.2 U6_4.9(B)
R6_14_2: R6_14.2 U6_4.11(B)
R6_15_2: R6_15.2 U6_4.13(B)
R6_16_2: R6_16.2 U6_4.15(B)
U1_2_3: JP1.1 U1_2.3(OUT+)
U3_8: R6_19.2 U3.8(EN)
U4_1_15: R4_1.1 U4_1.15(VREF) U4_2.1(+)
U4_2: R10.2 U4.2(CAT) U4.4(CAT) U4.6(CAT) U4.8(CAT)
U6_1_1: R6_1.2 U6_1.1(AN)
U6_1_2: D6_1.1(+) U6_1.2(CAT)
U6_1_3: R6_2.2 U6_1.3(AN)
U6_1_4: D6_2.1(+) U6_1.4(CAT)
U6_1_5: R6_3.2 U6_1.5(AN)
U6_1_6: D6_3.1(+) U6_1.6(CAT)
U6_1_8: D6_4.1(+) U6_1.8(CAT)
U6_1_9: R6_8.1 U6_1.9(EM)
U6_1_11: R6_7.1 U6_1.11(EM)
U6_1_13: R6_6.1 U6_1.13(EM)
U6_2_1: R6_9.2 U6_2.1(AN)
U6_2_2: D6_5.1(+) U6_2.2(CAT)
U6_2_3: R6_10.2 U6_2.3(AN)
U6_2_4: D6_6.1(+) U6_2.4(CAT)
U6_2_5: R6_11.2 U6_2.5(AN)
U6_2_6: D6_7.1(+) U6_2.6(CAT)
U6_2_8: D6_8.1(+) U6_2.8(CAT)
U6_2_9: R6_16.1 U6_2.9(EM)
U6_2_11: R6_15.1 U6_2.11(EM)
U6_2_13: R6_14.1 U6_2.13(EM)
U7_2: R11.2 U7.2(CAT) U7.4(CAT) U7.6(CAT) U7.8(CAT)
U12_2: R12.2 U12.2(CAT) U12.4(CAT) U12.6(CAT) U12.8(CAT)
U13_2: R13.2 U13.2(CAT) U13.4(CAT) U13.6(CAT) U13.8(CAT)

Not connected (* = marked no-connect by the designer): P2_1 1(3.3V)* 4(5V)* 17(3.3V)* 27(ID_SD)* 28(ID_SC)*; SW7_1 1* 3*; SW7_2 1* 3*; U2 3(DEC2)* 4(DEC3)* 12(DEC4)* 13(DCC)* 14(DEC1)*; U3_1 6(NC/2)* 9(NC)*; U3_2 6(NC/2)* 9(NC)*; U3_3 6(NC/2)* 9(NC)*; U3_4 4(A3)* 5(A4)* 6(NC/2)* 9(NC)* 10(B4)* 11(B3)*; U4_2 3(NC)*; U6 19(INTB)*; U8 19(INTB)*

## Notes on the sheets
sheet 1
- Level Shifter & driver bus
- ADC 12bits
- Transistors NPN
sheet 2
- LED & BUTTON
- Power
- Raspberry Pi
- NRF52832
sheet 4
- TRANSISTORS
- SPI
- IO_EXTENDER
- I2C
- UART
